# EAGLE design SparkFun_Soil_Moisture_Sensor (EAGLE 9.1.0)
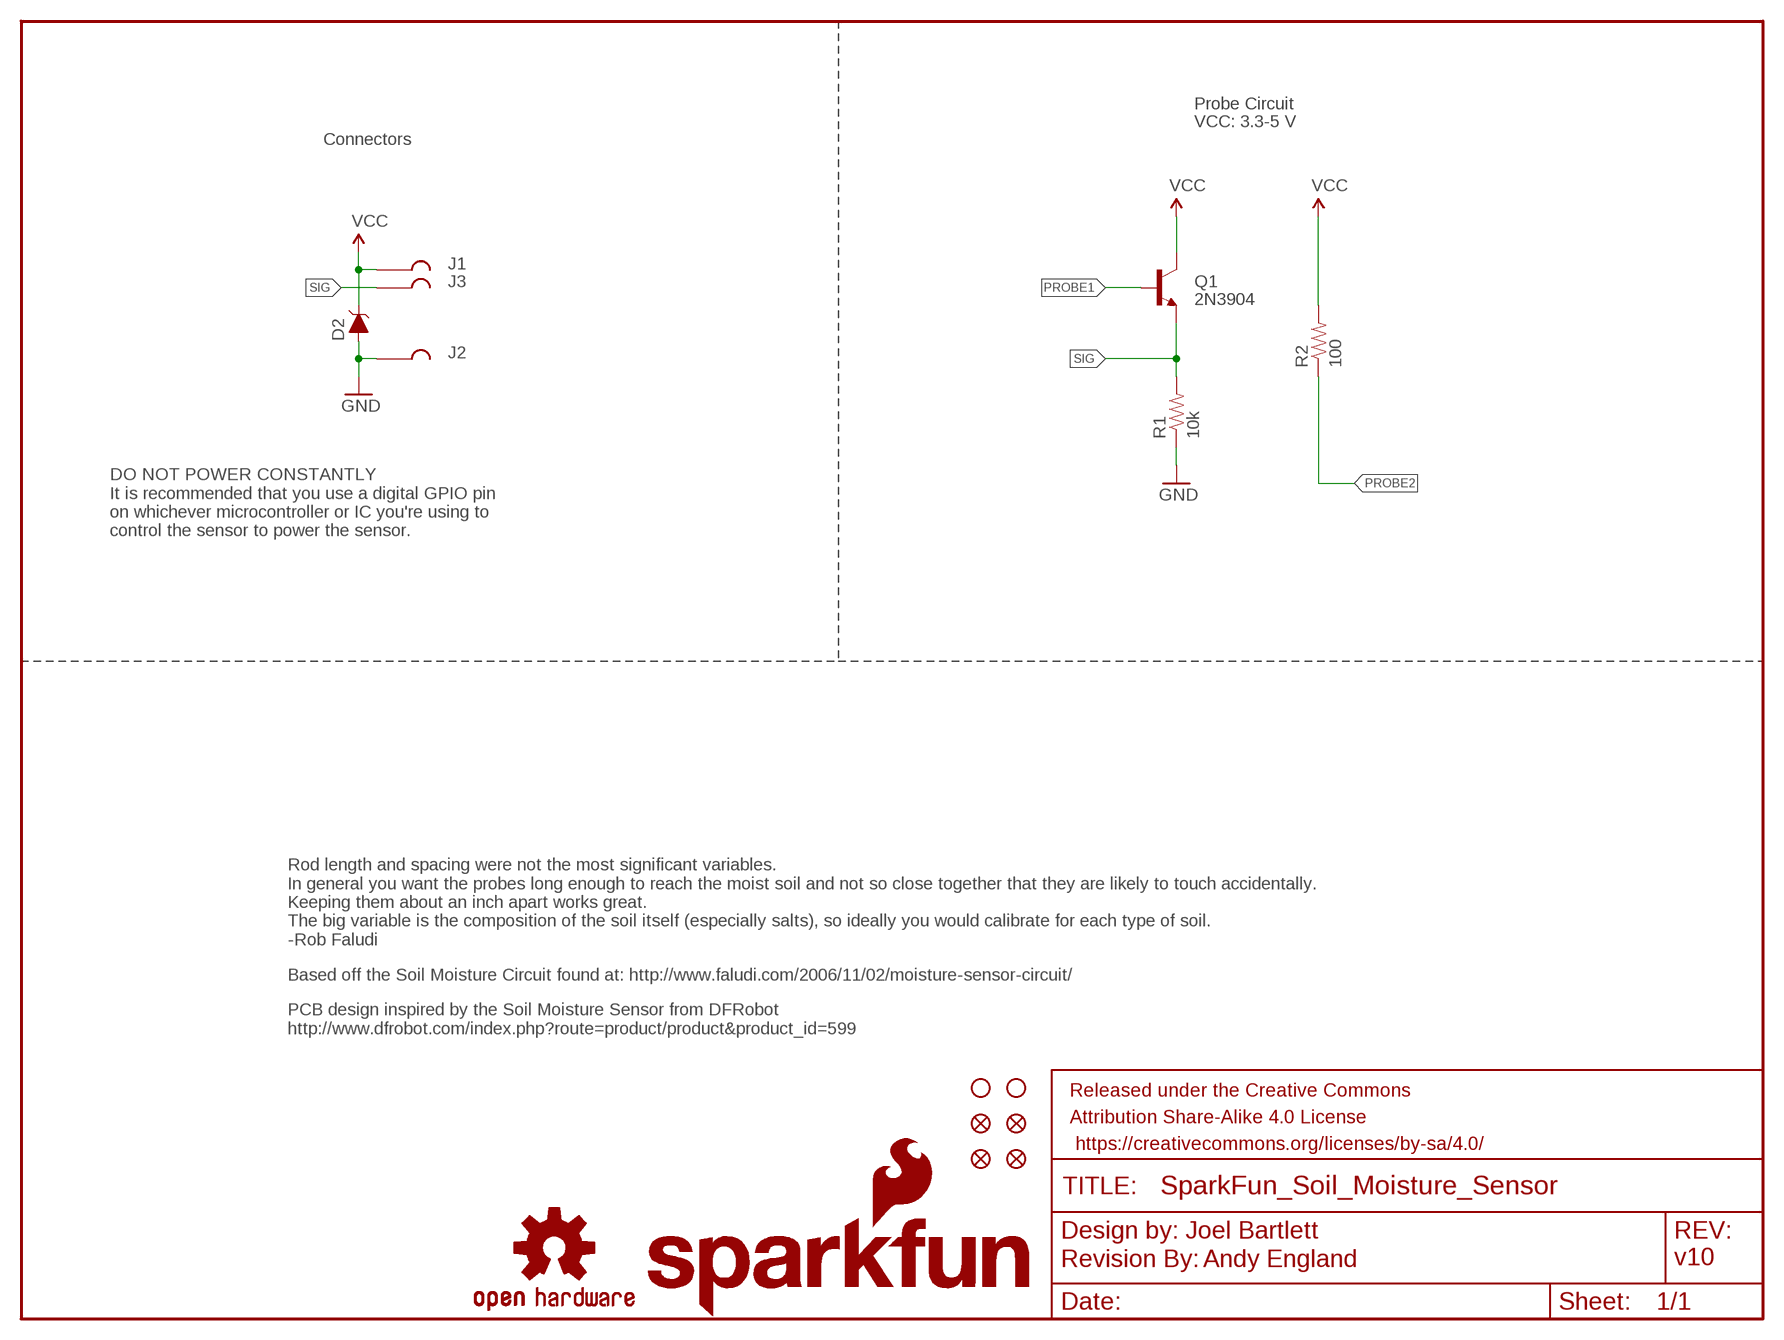
[diagram p0: schematic, sheet 1]

## Parts
D2  3.6V  DIODE-ZENER-BZT52C3V6S  [SOD-323]
FID1  FIDUCIAL1X2  [FIDUCIAL-1X2]
FID2  FIDUCIAL1X2  [FIDUCIAL-1X2]
FID3  FIDUCIAL1X2  [FIDUCIAL-1X2]
FID4  FIDUCIAL1X2  [FIDUCIAL-1X2]
FRAME1  FRAME-LETTER  [CREATIVE_COMMONS]
J1  GATORGATOR_MINI  [GATOR_MINI]
J2  GATORGATOR_MINI  [GATOR_MINI]
J3  GATORGATOR_MINI  [GATOR_MINI]
LOGO1  SFE_LOGO_NAME_FLAME.1_INCH  [SFE_LOGO_NAME_FLAME_.1]
LOGO2  OSHW-LOGOS  [OSHW-LOGO-S]
LOGO3  REVISION  [REVISION]
Q1  2N3904  TRANSISTOR_NPNMMBT2222A  [SOT23-3@1]
R1  10k  10KOHM-0603-1/10W-1%  [0603]
R2  100  100OHM-0603-1/10W-1%  [0603]
STANDOFF1  STAND-OFF  [STAND-OFF]
STANDOFF2  STAND-OFF  [STAND-OFF]

## Nets
GND: D2.A J2.P$2 R1.1
PROBE1: Q1.1(B)
PROBE2: R2.1
SIG: J3.P$2 Q1.2(E) R1.2
VCC: D2.C J1.P$2 Q1.3(C) R2.2

## Notes on the sheet
- Probe Circuit
- VCC: 3.3-5 V
- Connectors
- DO NOT POWER CONSTANTLY 
  It is recommended that you use a digital GPIO pin
  on whichever microcontroller or IC you're using to 
  control the sensor to power the sensor.
- Rod length and spacing were not the most significant variables. 
  In general you want the probes long enough to reach the moist soil and not so close together that they are likely to touch accidentally. 
  Keeping them about an inch apart works great. 
  The big variable is the composition of the soil itself (especially salts), so ideally you would calibrate for each type of soil. 
  -Rob Faludi
- Based off the Soil Moisture Circuit found at: http://www.faludi.com/2006/11/02/moisture-sensor-circuit/
- PCB design inspired by the Soil Moisture Sensor from DFRobot
  http://www.dfrobot.com/index.php?route=product/product&product_id=599
- Andy England | v10

## Library data of the parts
D2 = SparkFun-DiscreteSemi:DIODE-ZENER: Zener Diode A Zener diode allows current to flow from its anode to its cathode like a normal semiconductor diode, but it also permits current to flow in the reverse direction when its "Zener voltage" is reached. - WIkipedia; PROD_ID: DIO-08199
FID1-FID4 = SparkFun-Aesthetics:FIDUCIAL: Fiducial Alignment Points Various fiducial points for machine vision alignment.
FRAME1 = SparkFun-Aesthetics:FRAME-LETTER: Schematic Frame Standard 8.5x11 US Letter frame; DESIGNER: Joel Bartlett; VERSION: v10
J1-J3 = SparkFun-Connectors:GATOR
LOGO1 = SparkFun-Aesthetics:SFE_LOGO_NAME_FLAME: SFE Logo, name and flame This is the SparkFun full logo. The logo on the schematic will always be the same size; the package variant is the height of the flame part of the logo. Default layer for the logo on the board is tSilk.
LOGO2 = SparkFun-Aesthetics:OSHW-LOGO: Open Source Hardware Logo This logo indicates the piece of hardware it is found on incorporates a OSHW license and/or adheres to the definition of open source hardware found here: http://freedomdefined.org/OSHW
LOGO3 = SparkFun-Aesthetics:REVISION: "Revision By" Text Preceding text for revisor documentation. Includes schematic text on "symbols" layer, and board text on tDoc.
Q1 = SparkFun-DiscreteSemi:TRANSISTOR_NPN: Generic NPN BJT MMBT2222A - TRANS-08049 (SOT-23, 1A 40V) MPSA42 - TRANS-09116 (SOT-23, 500mA 300V) MMBT5088LT1G - TRANS-11160 (SOT-23, 50 mA 30V) BC547 - COM-08928 <http://www.sparkfun.com/products/8928> (TO-92 45V 100mA) (1.Collector 2.Base 3.Emitter) 2N3904 - COM-00521 <http://www.sparkfun.com/products/521> (TO-92 40V 200mA) (1.Emitter 2.Base 3.Collector) P2N2222A - COM-12852 <http://www.sparkfun.com/products/12852> (TO-92 40V 600mA) (1.Collector 2.Base 3.Emitter); PROD_ID: TRANS-08049; VALUE: MMBT2222A
R1 = SparkFun-Resistors:10KOHM: 10kΩ resistor A resistor is a passive two-terminal electrical component that implements electrical resistance as a circuit element. Resistors act to reduce current flow, and, at the same time, act to lower voltage levels within circuits. - Wikipedia; PROD_ID: RES-00824
R2 = SparkFun-Resistors:100OHM: 100Ω resistor A resistor is a passive two-terminal electrical component that implements electrical resistance as a circuit element. Resistors act to reduce current flow, and, at the same time, act to lower voltage levels within circuits. - Wikipedia; PROD_ID: RES-07863
STANDOFF1 STANDOFF2 = SparkFun-Electromechanical:STAND-OFF: #4 Stand Off This is the mechanical footprint for a #4 phillips button head screw. Use the keepout ring to avoid running the screw head into surrounding components. SKU : PRT-00447

## Board
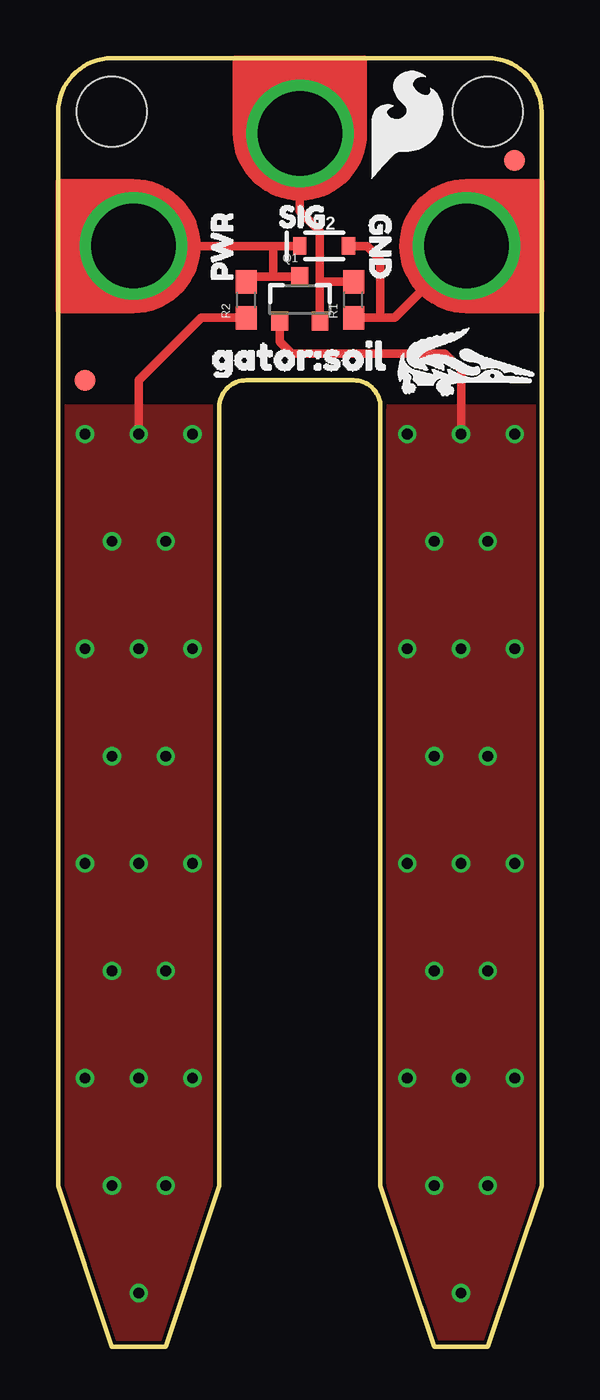
[diagram p1: board, top side]
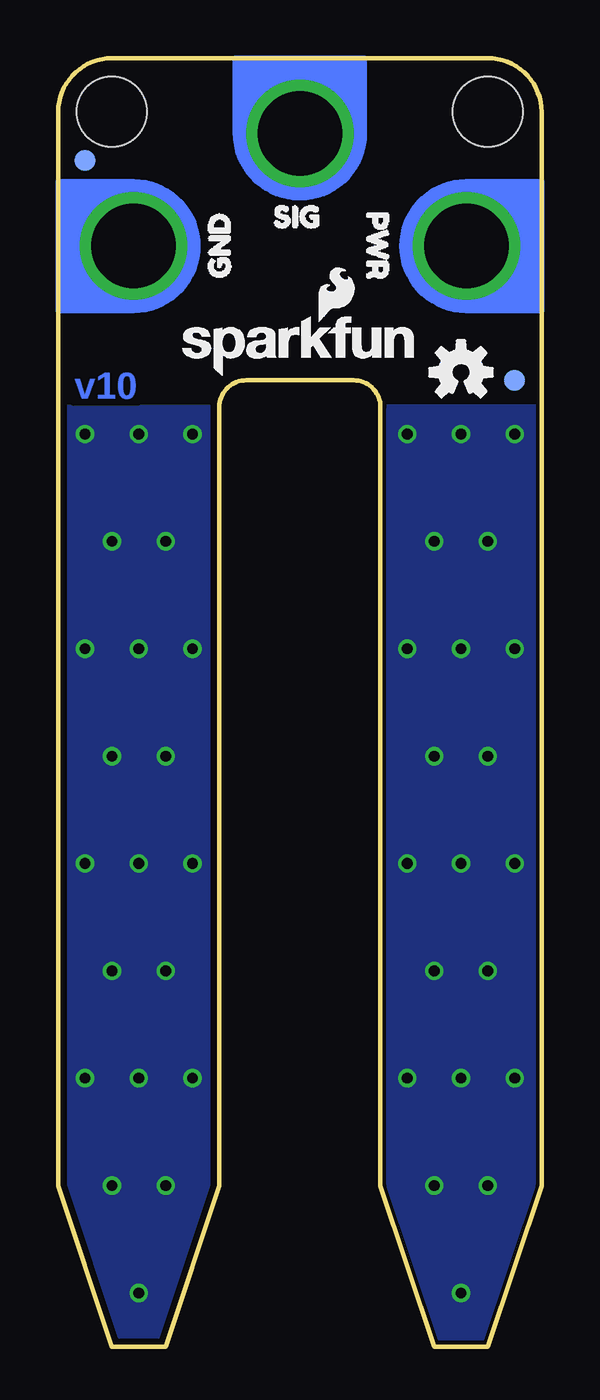
[diagram p2: board, bottom side, seen from below]

Size 22.86 x 60.96 mm. Coordinates in mm from the lower left corner, seen from the top.
Outline: 0,58.42 0,7.62 2.54,0 5.08,0 7.62,7.62 7.62,44.45 arc-90 8.89,45.72 13.97,45.72 arc-90 15.24,44.45 15.24,7.62 17.78,0 20.32,0 22.86,7.62 22.86,58.42 arc90 20.32,60.96 2.54,60.96 arc90 0,58.42
Copper layers (1*16): Top 0.035mm / dielectric 1.5mm / Bottom 0.035mm
Design rules "SparkFun-2-layer-TIGHT": minimum track width 7mil, minimum drill 15mil, track to track 7mil, track to pad 7mil, pad to pad 7mil, via to via 7mil, smd to smd 7mil, copper to edge 7mil, drill to drill 7mil, minimum pad ring 7mil, minimum via ring 7mil, stop-mask expansion 4mil, vias tented up to drill 25mil, thermal gap 10mil

### Footprints (pad centres in the part's own frame; a part is rotated, then mirrored left to right if it is on the bottom)
SOD-323 = smd 0.63 x 0.83: A 1.15,0; C -1.15,0
FIDUCIAL-1X2 = smd 1 x 1: 1 0,0
GATOR_MINI = drill 4 pad 5.08: P$2 0,-0.254
SOT23-3@1 = smd 0.8 x 0.9: 1 -0.95,-1; 2 0.95,-1; 3 0,1.1
0603 = smd 1.1 x 1: 1 -0.85,0; 2 0.85,0
STAND-OFF = hole 3.302: 0,0

### Placement (x,y rotation side)
D2  12.57,52.07 0 top
FID1  21.59,56.13 0 top
FID2  1.27,45.72 0 top
FID3  1.27,45.72 0 bottom
FID4  21.59,56.13 0 bottom
FRAME1  -7.62,-10.16 0 top  (outside the outline)
J1  3.81,52.07 270 top
J2  19.05,52.07 90 top
J3  11.43,57.15 180 top
LOGO1  17.4,45.85 0 bottom
LOGO2  3.81,46.1 0 bottom
LOGO3  3.81,-12.7 0 top  (outside the outline)
Q1  11.43,49.53 0 top
R1  13.97,49.53 90 top
R2  8.89,49.53 90 top
STANDOFF1  2.54,58.42 0 top
STANDOFF2  20.32,58.42 0 top
U$1  [PWR2]  7.75,49.53 90 top
U$2  [GND0]  15.24,54.48 270 top
U$3  [SIG1]  9.53,53.47 0 top
U$4  [SFE_LOGO_FLAME_.2]  14.48,54.99 0 top
U$5  [SIG1]  13.59,53.47 0 bottom
U$6  [PWR2]  7.75,54.61 270 bottom
U$7  [GND0]  15.24,49.66 90 bottom
U$8  [GATOR#SOIL1]  6.1,46.86 0 top
U$10  [ORDERING_INSTRUCTIONS]  -6.35,-16.51 0 top  (outside the outline)
U$11  [GATORBIT_FINAL_FOR_SILK#01#PNG]  19.3,46.61 0 top

### Tracks (layer width: path | path; a pad name or v marks a point on that pad's centre or on a via)
GND
  Top 0.406: J2.P$2 15.91,48.68 15.24,48.68 | 15.24,48.68 R1.1 | 15.24,48.68 15.24,51.44 14.61,52.07 D2.A
PROBE1  (via drill 0.51)
  Top 0.406: Q1.1 10.48,47.56 11.05,46.99 18.29,46.99 19.05,46.23 v19.05,43.18
  other vias: 16.51,43.18 21.59,43.18 21.59,33.02 19.05,33.02 16.51,33.02 16.51,22.86 19.05,22.86 21.59,22.86 21.59,12.7 19.05,12.7 16.51,12.7 17.78,7.62 20.32,7.62 19.05,2.54 17.78,38.1 20.32,38.1 20.32,27.94 17.78,27.94 17.78,17.78 20.32,17.78
  pour Top: 15.24,44.45 15.24,0 22.86,0 22.86,44.45
  pour Bottom (isolate 0.305): 15.24,44.45 15.24,0 22.86,0 22.86,44.45
PROBE2  (via drill 0.51)
  Top 0.406: v3.81,43.18 3.81,45.72 6.77,48.68 R2.1
  other vias: 6.35,43.18 1.27,43.18 1.27,33.02 3.81,33.02 6.35,33.02 6.35,22.86 3.81,22.86 1.27,22.86 1.27,12.7 3.81,12.7 6.35,12.7 5.08,7.62 2.54,7.62 3.81,2.54 2.54,17.78 5.08,17.78 2.54,27.94 5.08,27.94 2.54,38.1 5.08,38.1
  pour Top: 0,44.45 0,0 7.62,0 7.62,44.45
  pour Bottom: 0,44.45 0,0 7.62,0 7.62,44.45
SIG
  Top 0.406: J3.P$2 11.43,53.72 12.38,52.77 12.38,50.29 | 12.38,50.29 Q1.2 | 12.38,50.29 12.47,50.38 R1.2
VCC
  Top 0.254: R2.2 9.14,50.63
  Top 0.406: 9.14,50.63 10.16,50.63 | 10.16,50.63 Q1.3 | J1.P$2 10.16,52.07 | 10.16,52.07 D2.C | 10.16,50.63 10.16,52.07

### Text on the board
Bottom: v10
tDocu: Joel Bartlett | Andy England | Black Gloss Soldermask